# Altium schematic sheet 780-00055, rev2, Pg5, SCH, NRES Temp Meas, 8-Chan RTD .SchDoc
size B; PageSetup: Record=PageOptions|CenterHorizontal=True|CenterVertical=True|PrintScale=1.12|XCorrection=1.00|YCorrection=1.00|PrintKind=0|BorderSize=5000000|LeftOffset=0|BottomOffset=0|Orientation=2|PaperLength=1000|PaperWidth=1000|Scale=100|PaperSource=15|PrintQuality=600|MediaType=1|DitherType=10|PrintScaleMode=1|PaperKind=Tabloid|PaperIndex=3
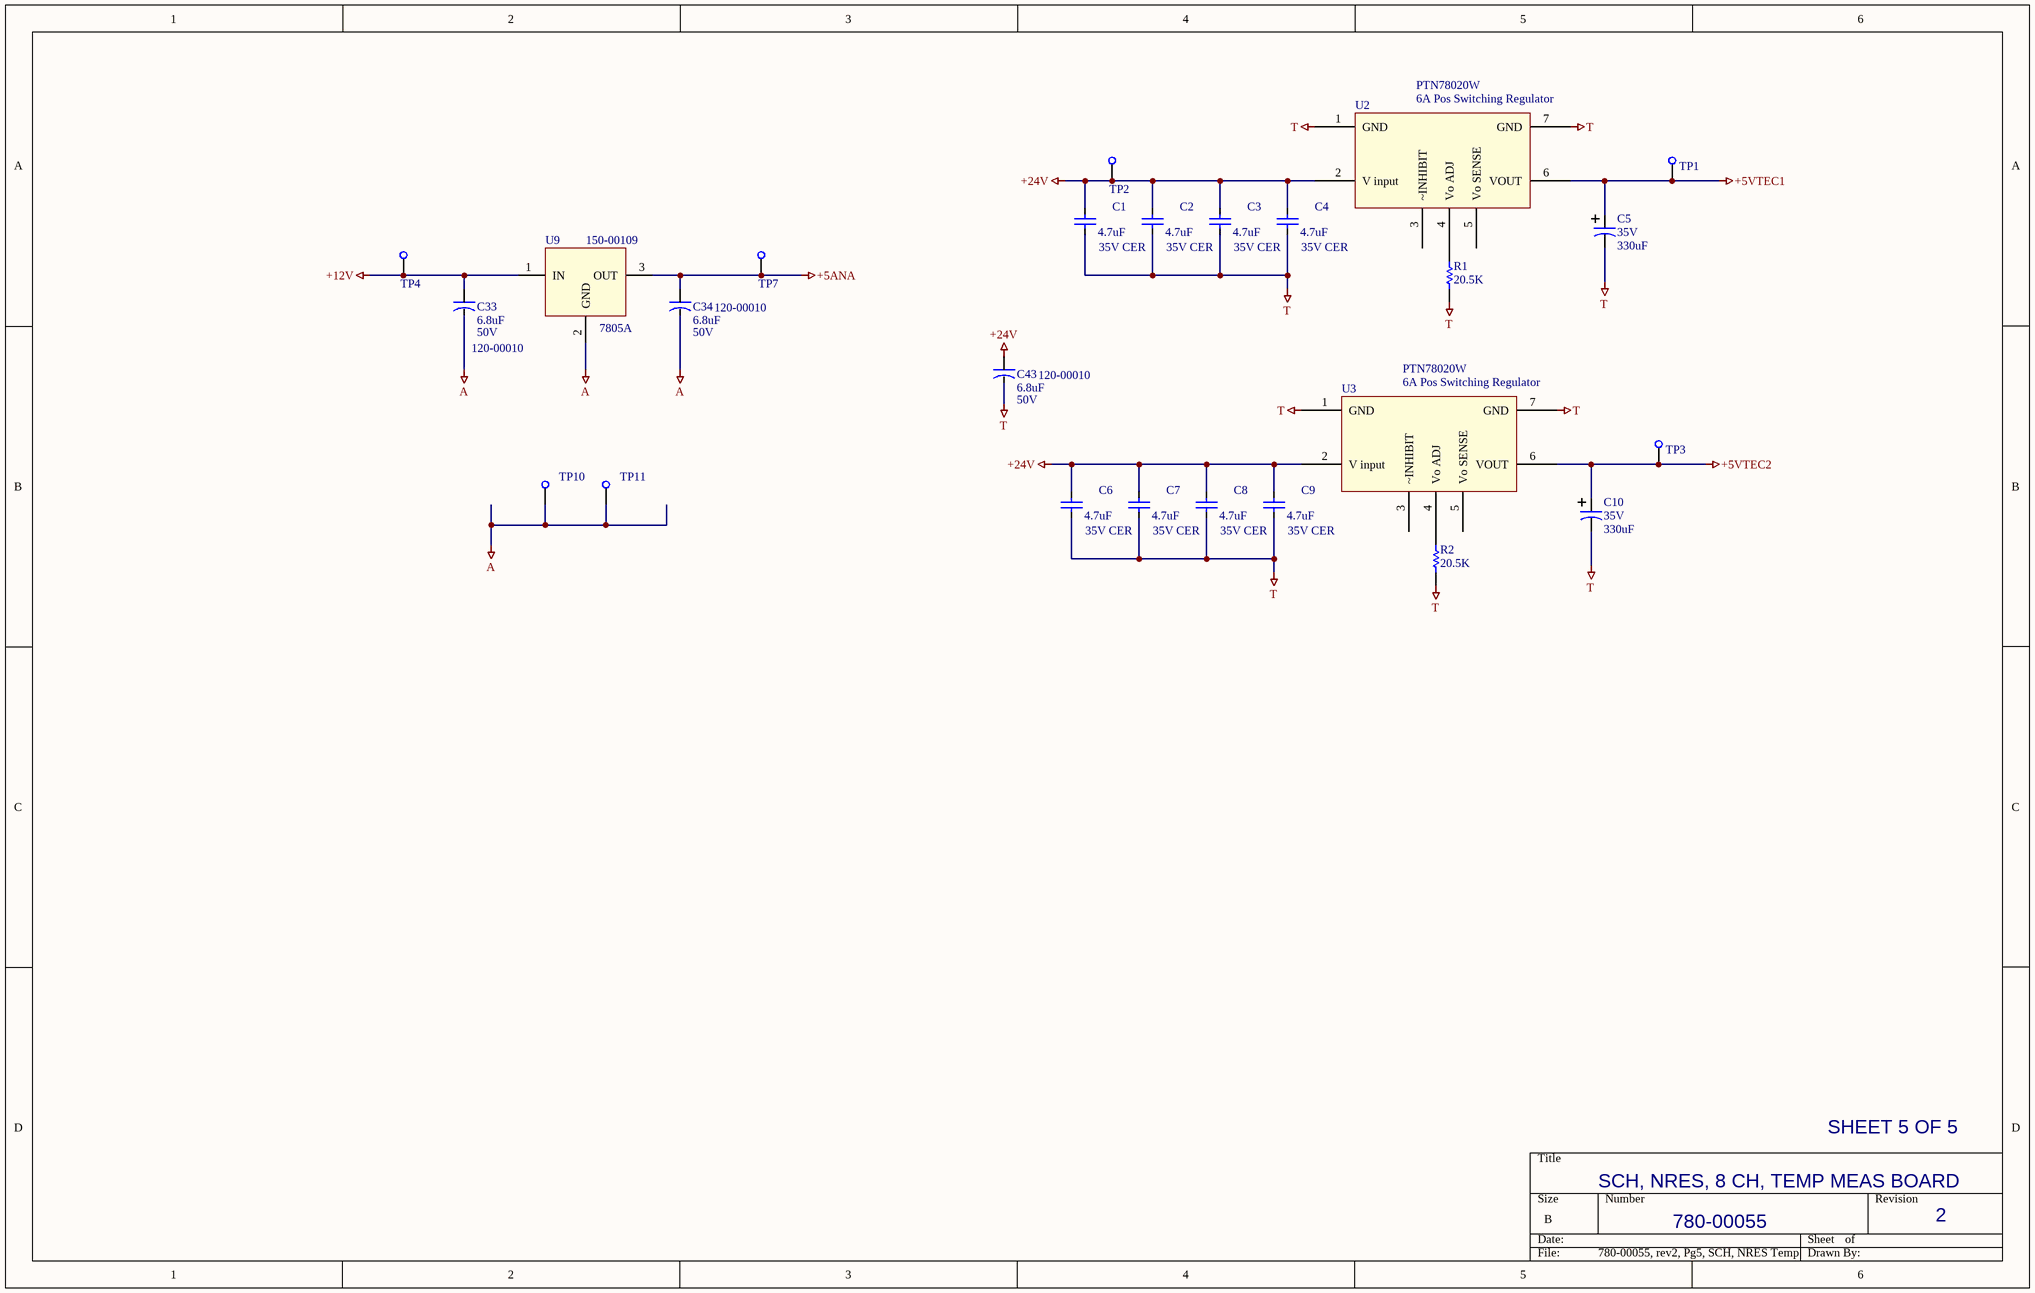
[diagram p0: 780-00055, rev2, Pg5, SCH, NRES Temp Meas, 8-Chan RTD .SchDoc]

## Parts
C1  35V CER  value 4.7uF  [SMD_0805]
C2  35V CER  value 4.7uF  [SMD_0805]
C3  35V CER  value 4.7uF  [SMD_0805]
C4  35V CER  value 4.7uF  [SMD_0805]
C5  35V  value 330uF  [CAP, Thru Hole 10mm dia]
C6  35V CER  value 4.7uF  [SMD_0805]
C7  35V CER  value 4.7uF  [SMD_0805]
C8  35V CER  value 4.7uF  [SMD_0805]
C9  35V CER  value 4.7uF  [SMD_0805]
C10  35V  value 330uF  [CAP, Thru Hole 10mm dia]
C33  50V  value 6.8uF  LCO P/N: 120-00010  [SMD_CAP_6032]
C34  50V  value 6.8uF  LCO P/N: 120-00010  [SMD_CAP_6032]
C43  50V  value 6.8uF  LCO P/N: 120-00010  [SMD_CAP_6032]
R1  value 20.5K  [SMD_0805]  (hidden comment: Res 0805)
R2  value 20.5K  [SMD_0805]  (hidden comment: Res 0805)
TP1  Test point  [PAD_80D_052H]  (value not drawn)
TP2  Test point  [PAD_80D_052H]  (value not drawn)
TP3  Test point  [PAD_80D_052H]  (value not drawn)
TP4  Test point  [PAD_80D_052H]  (value not drawn)
TP7  Test point  [PAD_80D_052H]  (value not drawn)
TP10  Test point  [PAD_80D_052H]  (value not drawn)
TP11  Test point  [PAD_80D_052H]  (value not drawn)
U2  6A Pos Switching Regulator  value PTN78020W  [TEXAS Inst Switching Regulator]
U3  6A Pos Switching Regulator  value PTN78020W  [TEXAS Inst Switching Regulator]
U9  value 7805A  LCO p/n: 150-00109  [TO-220 w/Heatsink 7136DG]  (hidden comment: Voltage Reg, Pos Fixed)

## Nets
+5ANA: C34.pos TP7.1(TP) U9.3(OUT)
+5VTEC1: C5.1 TP1.1(TP) U2.6(VOUT)
+5VTEC2: C10.1 TP3.1(TP) U3.6(VOUT)
+12V: C33.pos TP4.1(TP) U9.1(IN)
+24V: C1.2 C2.2 C3.2 C4.2 C6.2 C7.2 C8.2 C9.2 C43.pos TP2.1(TP) U2.2(V_input) U3.2(V_input)
A: C33.neg C34.neg TP10.1(TP) TP11.1(TP) U9.2(GND)
T: C1.1 C2.1 C3.1 C4.1 C5.2 C6.1 C7.1 C8.1 C9.1 C10.2 C43.neg R1.1 R2.1 U2.1(GND) U2.7(GND) U3.1(GND) U3.7(GND)
NetR1_2: R1.2 U2.4(Vo_ADJ)
NetR2_2: R2.2 U3.4(Vo_ADJ)

Not connected (* = marked no-connect by the designer): U2 3(~INHIBIT) 5(Vo_SENSE); U3 3(~INHIBIT) 5(Vo_SENSE)

## Notes on the sheet
- SHEET 5 OF 5
- SCH, NRES, 8 CH, TEMP MEAS BOARD
- 780-00055
- 2

## Library data of the parts
C1-C4 C6-C9 = Cap SMD: Capacitor; LCO p/n: 120-00051
C5 C10 = Cap Elec, 330 uF, 35V: Radial Thru hole; LCO p/n: 120-00053
C33 C34 C43 = Cap Tant 35V: outline 6.0mm x 3.2mm; Manufacturer: AVX; Manuf p/n: TAJC685K050RNJ; Vendor: DigiKey; Vendor p/n: 478-4776-1-ND; Vendor Mult.: 1; COST: 1.55
R1 R2 = Res SMD: Resistor 0805; Manufacturer: Vishay/Dale; Manuf p/n: CRCW080520.5KFKEA; Vendor: DIGIKEY; Vendor p/n: 541-20.5KCCT-ND; Vendor Mult.: 10; LCO p/n: 181-02052; COST: 0.09
TP1-TP4 TP7 TP10 TP11 = Test point: Manufacturer: Keystone; Manuf p/n: 1249; Vendor: Bisco Ind.; LCO p/n: 125-00013; Vendor p/n: 1249; COST: 0.18; VALUE: Test point
U2 U3 = PTN78020W: Pos Adj Switching Regulator; LCO p/n: 150-00088
U9 = Voltage Reg, Pos Fixed: 7805A; Manufacturer: On Semi; Vendor: Digi-Key; Vendor Mult.: 1; COST: 0.61